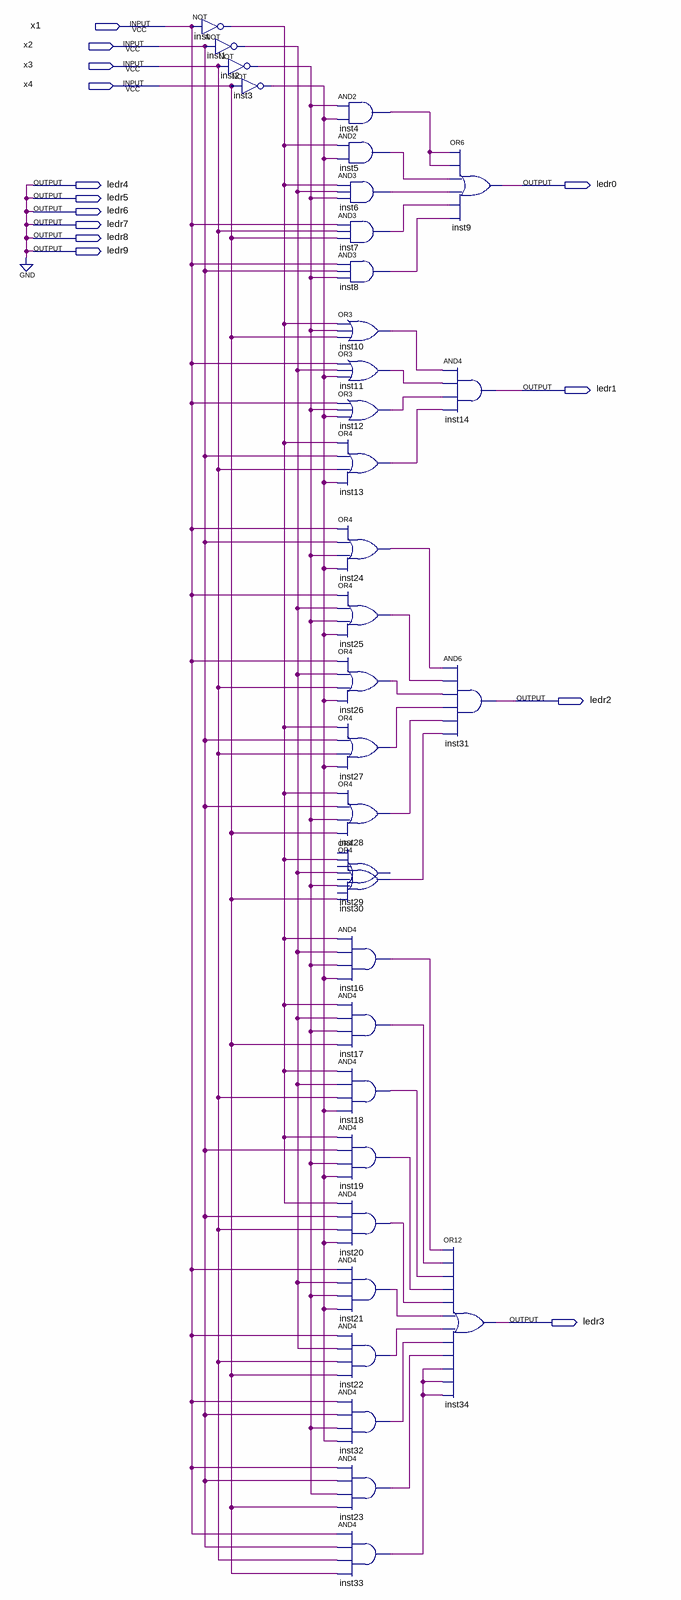
[diagram p0: schematic sheet]
// Quartus schematic Lab2.bdf as structural Verilog: 34 symbols, 14 pins
module Lab2 (
  input  x1,
  input  x2,
  input  x3,
  input  x4,
  output ledr4,
  output ledr0,
  output ledr5,
  output ledr6,
  output ledr7,
  output ledr8,
  output ledr9,
  output ledr1,
  output ledr2,
  output ledr3
);

  wire inst1_out, inst2_out, inst3_out, inst4_out, inst5_out, inst6_out, inst7_out, inst8_out, inst10_out,
       inst11_out, inst12_out, inst13_out, inst16_out, inst17_out, inst18_out, inst19_out, inst20_out,
       inst21_out, inst22_out, inst23_out, inst24_out, inst25_out, inst26_out, inst27_out, inst28_out,
       inst30_out, inst32_out, inst33_out, inst_out;

  not inst (inst_out, x1);
  not inst1 (inst1_out, x2);
  not inst2 (inst2_out, x3);
  not inst3 (inst3_out, x4);
  and inst4 (inst4_out, inst2_out, inst3_out);
  and inst5 (inst5_out, inst_out, inst3_out);
  and inst6 (inst6_out, inst_out, inst1_out, inst2_out);
  and inst7 (inst7_out, x1, x3, x4);
  and inst8 (inst8_out, x1, x2, inst2_out);
  or inst10 (inst10_out, inst_out, inst2_out, x4);
  or inst11 (inst11_out, x1, inst1_out, inst3_out);
  or inst12 (inst12_out, x1, inst2_out, inst3_out);
  or inst13 (inst13_out, inst_out, x2, x3, inst3_out);
  or inst24 (inst24_out, x1, x2, inst2_out, inst3_out);
  or inst25 (inst25_out, x1, inst1_out, inst2_out, inst3_out);
  or inst26 (inst26_out, x1, inst1_out, x3, inst3_out);
  or inst27 (inst27_out, inst_out, x2, x3, inst3_out);
  or inst28 (inst28_out, inst_out, x2, inst2_out, x4);
  // OR4 inst29 is placed but not wired
  or inst30 (inst30_out, inst_out, inst1_out, inst2_out, x4);
  and inst16 (inst16_out, inst_out, inst1_out, inst2_out, inst3_out);
  and inst17 (inst17_out, inst_out, inst1_out, inst2_out, x4);
  and inst18 (inst18_out, inst_out, inst1_out, x3, inst3_out);
  and inst19 (inst19_out, inst_out, x2, inst2_out, inst3_out);
  and inst20 (inst20_out, inst_out, x2, x3, inst3_out);
  and inst21 (inst21_out, x1, inst1_out, inst2_out, inst3_out);
  and inst22 (inst22_out, x1, inst1_out, x3, x4);
  and inst32 (inst32_out, x1, x2, inst2_out, inst3_out);
  and inst23 (inst23_out, x1, x2, inst2_out, x4);
  and inst33 (inst33_out, x1, x2, x3, x4);
  and inst14 (ledr1, inst10_out, inst11_out, inst12_out, inst13_out);
  and inst31 (ledr2, inst24_out, inst25_out, inst26_out, inst27_out, inst28_out, inst30_out);
  or inst34 (ledr3, inst16_out, inst17_out, inst18_out, inst19_out, inst20_out, inst21_out, inst22_out, inst32_out, inst23_out, inst33_out, inst33_out, inst33_out);
  or inst9 (ledr0, inst4_out, inst4_out, inst5_out, inst6_out, inst7_out, inst8_out);

  assign ledr4 = 1'b0;
  assign ledr5 = 1'b0;
  assign ledr6 = 1'b0;
  assign ledr7 = 1'b0;
  assign ledr8 = 1'b0;
  assign ledr9 = 1'b0;
endmodule
